# EAGLE schematic COUNTER SMD (EAGLE 7.5.0)
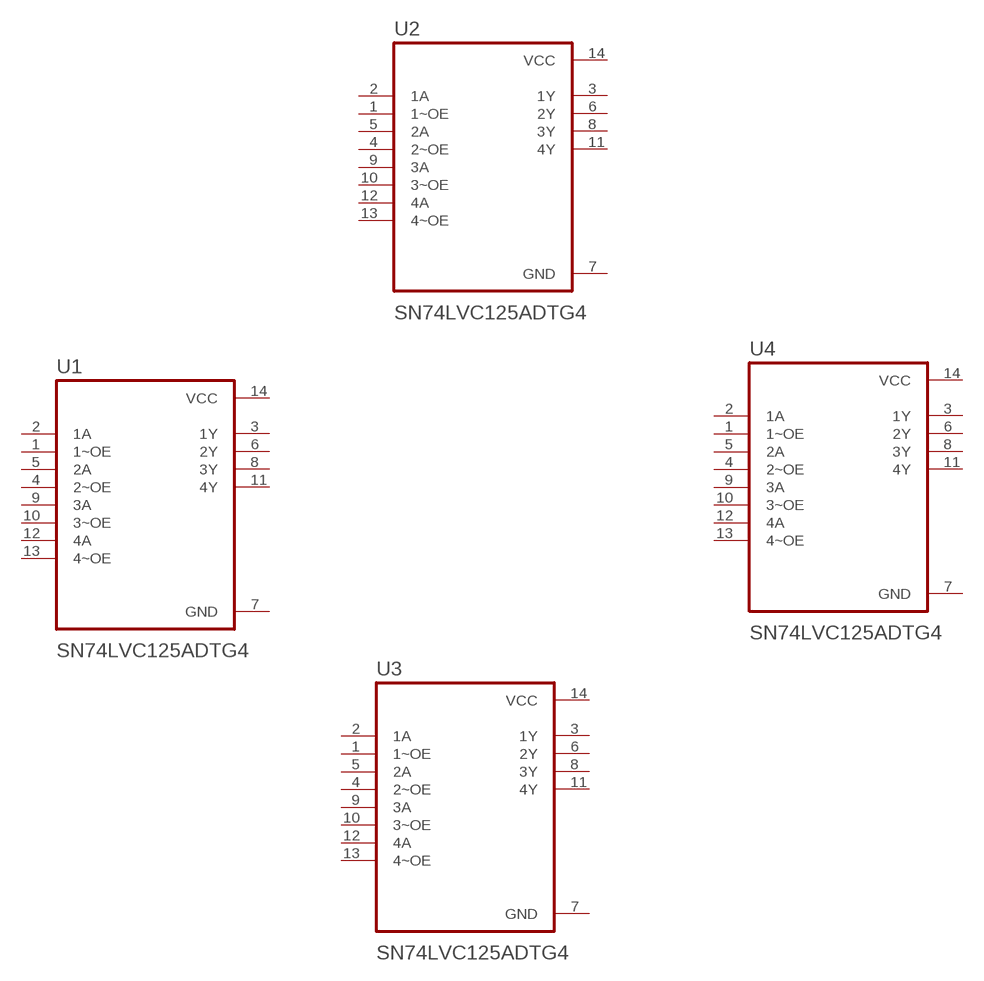
[diagram p0: schematic, sheet 1]

## Parts
U1  SN74LVC125ADTG4  [SOIC127P600X175-14N]
U2  SN74LVC125ADTG4  [SOIC127P600X175-14N]
U3  SN74LVC125ADTG4  [SOIC127P600X175-14N]
U4  SN74LVC125ADTG4  [SOIC127P600X175-14N]
Unconnected: U1.1(1~OE) U1.2(1A) U1.3(1Y) U1.4(2~OE) U1.5(2A) U1.6(2Y) U1.8(3Y) U1.9(3A) U1.10(3~OE) U1.11(4Y) U1.12(4A) U1.13(4~OE) U2.1(1~OE) U2.2(1A) U2.3(1Y) U2.4(2~OE) U2.5(2A) U2.6(2Y) U2.8(3Y) U2.9(3A) U2.10(3~OE) U2.11(4Y) U2.12(4A) U2.13(4~OE) U3.1(1~OE) U3.2(1A) U3.3(1Y) U3.4(2~OE) U3.5(2A) U3.6(2Y) U3.8(3Y) U3.9(3A) U3.10(3~OE) U3.11(4Y) U3.12(4A) U3.13(4~OE) U4.1(1~OE) U4.2(1A) U4.3(1Y) U4.4(2~OE) U4.5(2A) U4.6(2Y) U4.8(3Y) U4.9(3A) U4.10(3~OE) U4.11(4Y) U4.12(4A) U4.13(4~OE)

## Power pins joined to a net without a drawn wire
GND: U1.7(GND) U2.7(GND) U3.7(GND) U4.7(GND)
VCC: U1.14(VCC) U2.14(VCC) U3.14(VCC) U4.14(VCC)

## Library data of the parts
U1-U4 = SN74LVC125ADTG4:SN74LVC125ADTG4: Check availability <https://pricing.snapeda.com/parts/SN74LVC125ADTG4/Texas%20Instruments/view-part?ref=eda>; AVAILABILITY: In Stock; DESCRIPTION: Quadruple Bus Buffer Gate With 3-State Outputs 14-SOIC -40 to 125; MF: Texas Instruments; MP: SN74LVC125ADTG4; PACKAGE: SOIC-14 Texas Instruments; PRICE: None; PURCHASE-URL: https://pricing.snapeda.com/search/part/SN74LVC125ADTG4/?ref=eda